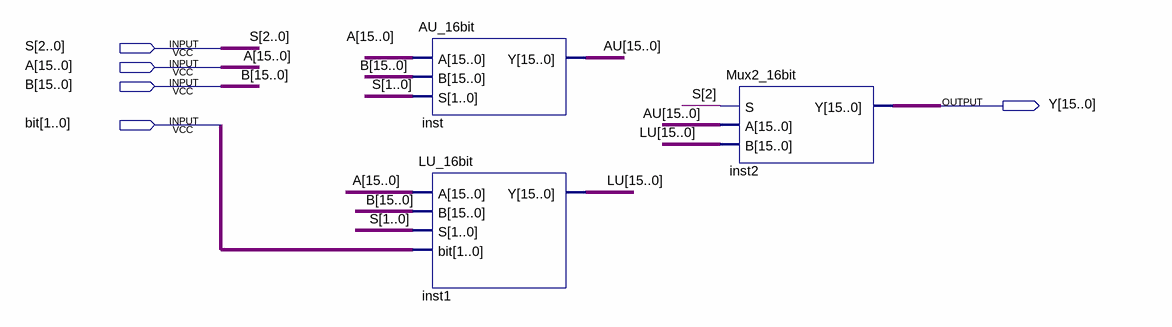
[diagram p0: schematic sheet]
// Quartus schematic ALU_16bit.bdf as structural Verilog: 3 symbols, 5 pins
module ALU_16bit (
  input  [2:0] S,
  input  [15:0] A,
  input  [15:0] B,
  input  [1:0] \bit ,
  output [15:0] Y
);

  wire [15:0] AU, LU;

  AU_16bit inst (.A(A), .B(B), .S(S[1:0]), .Y(AU));
  LU_16bit inst1 (.A(A), .B(B), .S(S[1:0]), .\bit (\bit ), .Y(LU));
  Mux2_16bit inst2 (.S(S[2]), .A(AU), .B(LU), .Y(Y));
endmodule
